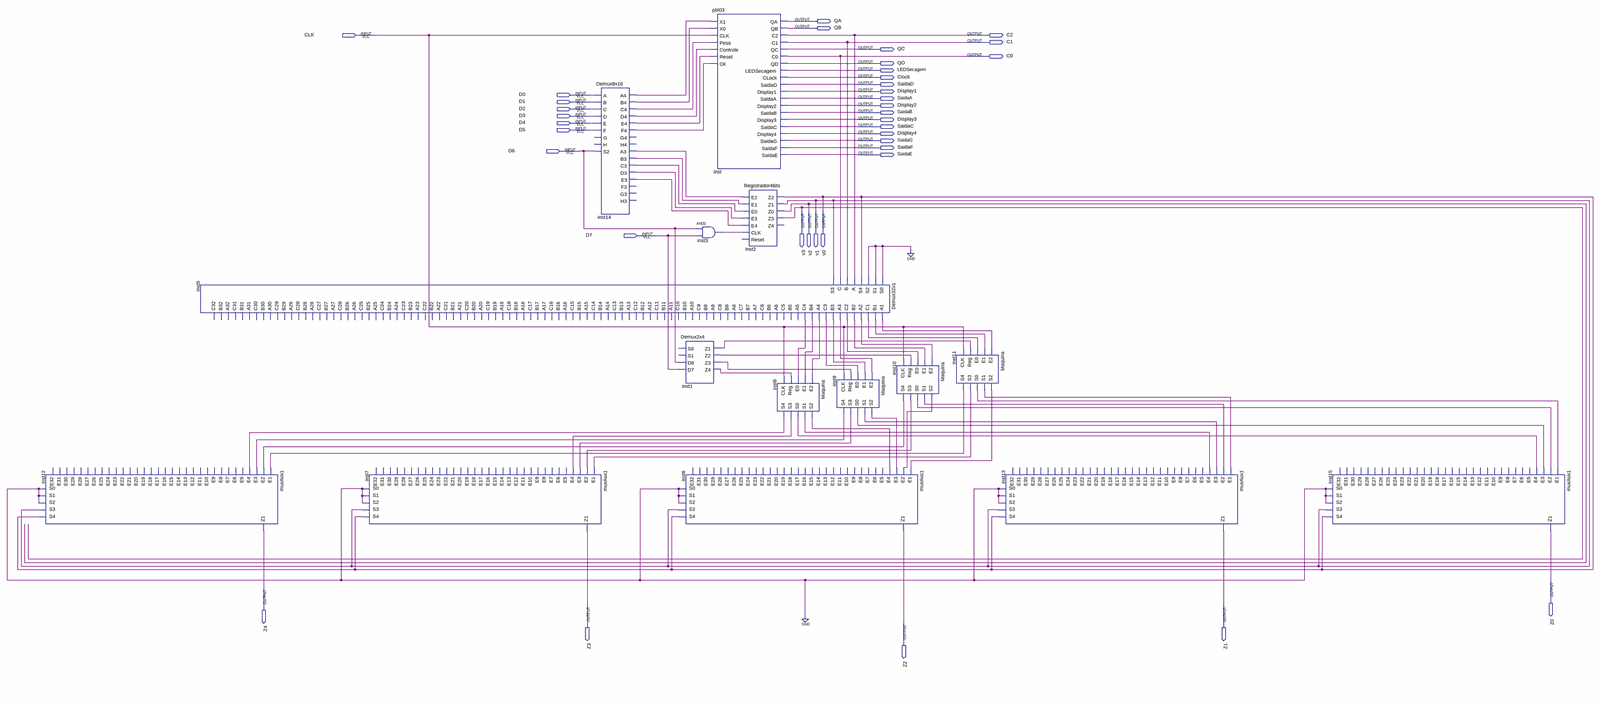
[diagram p0: schematic sheet, whole]
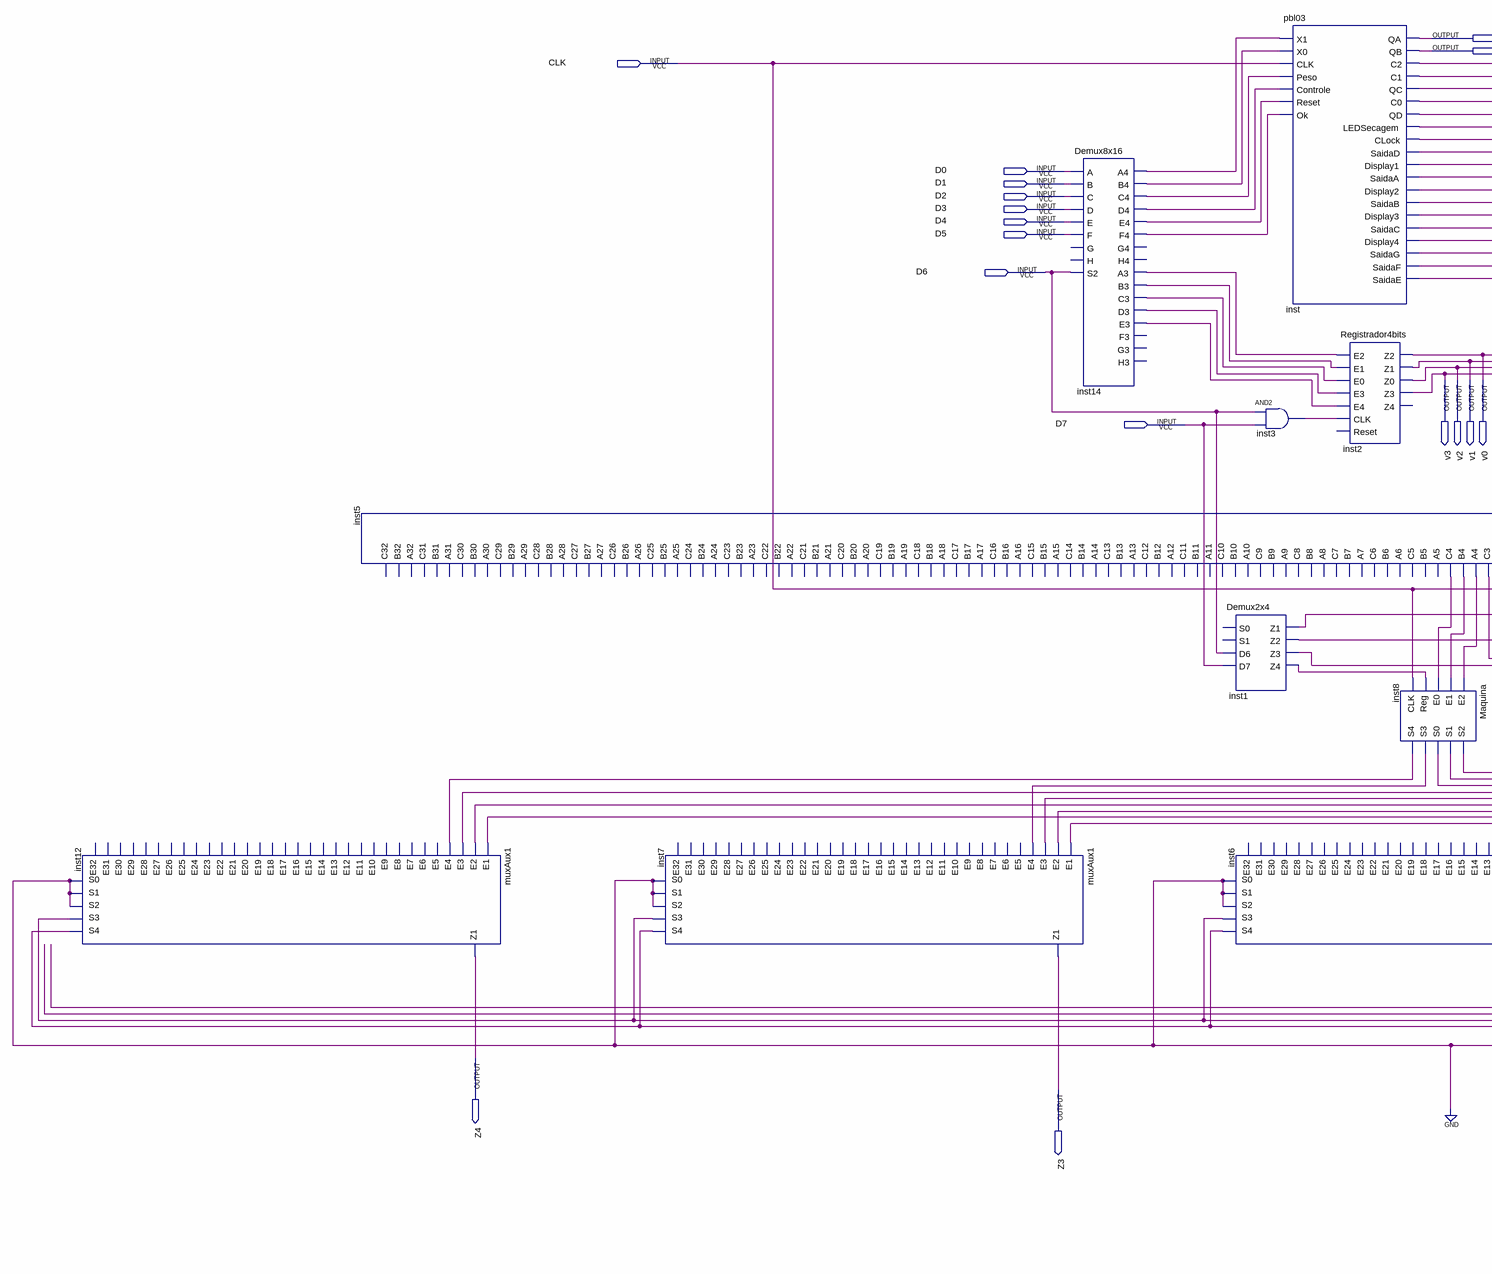
[diagram p1: schematic sheet, left part]
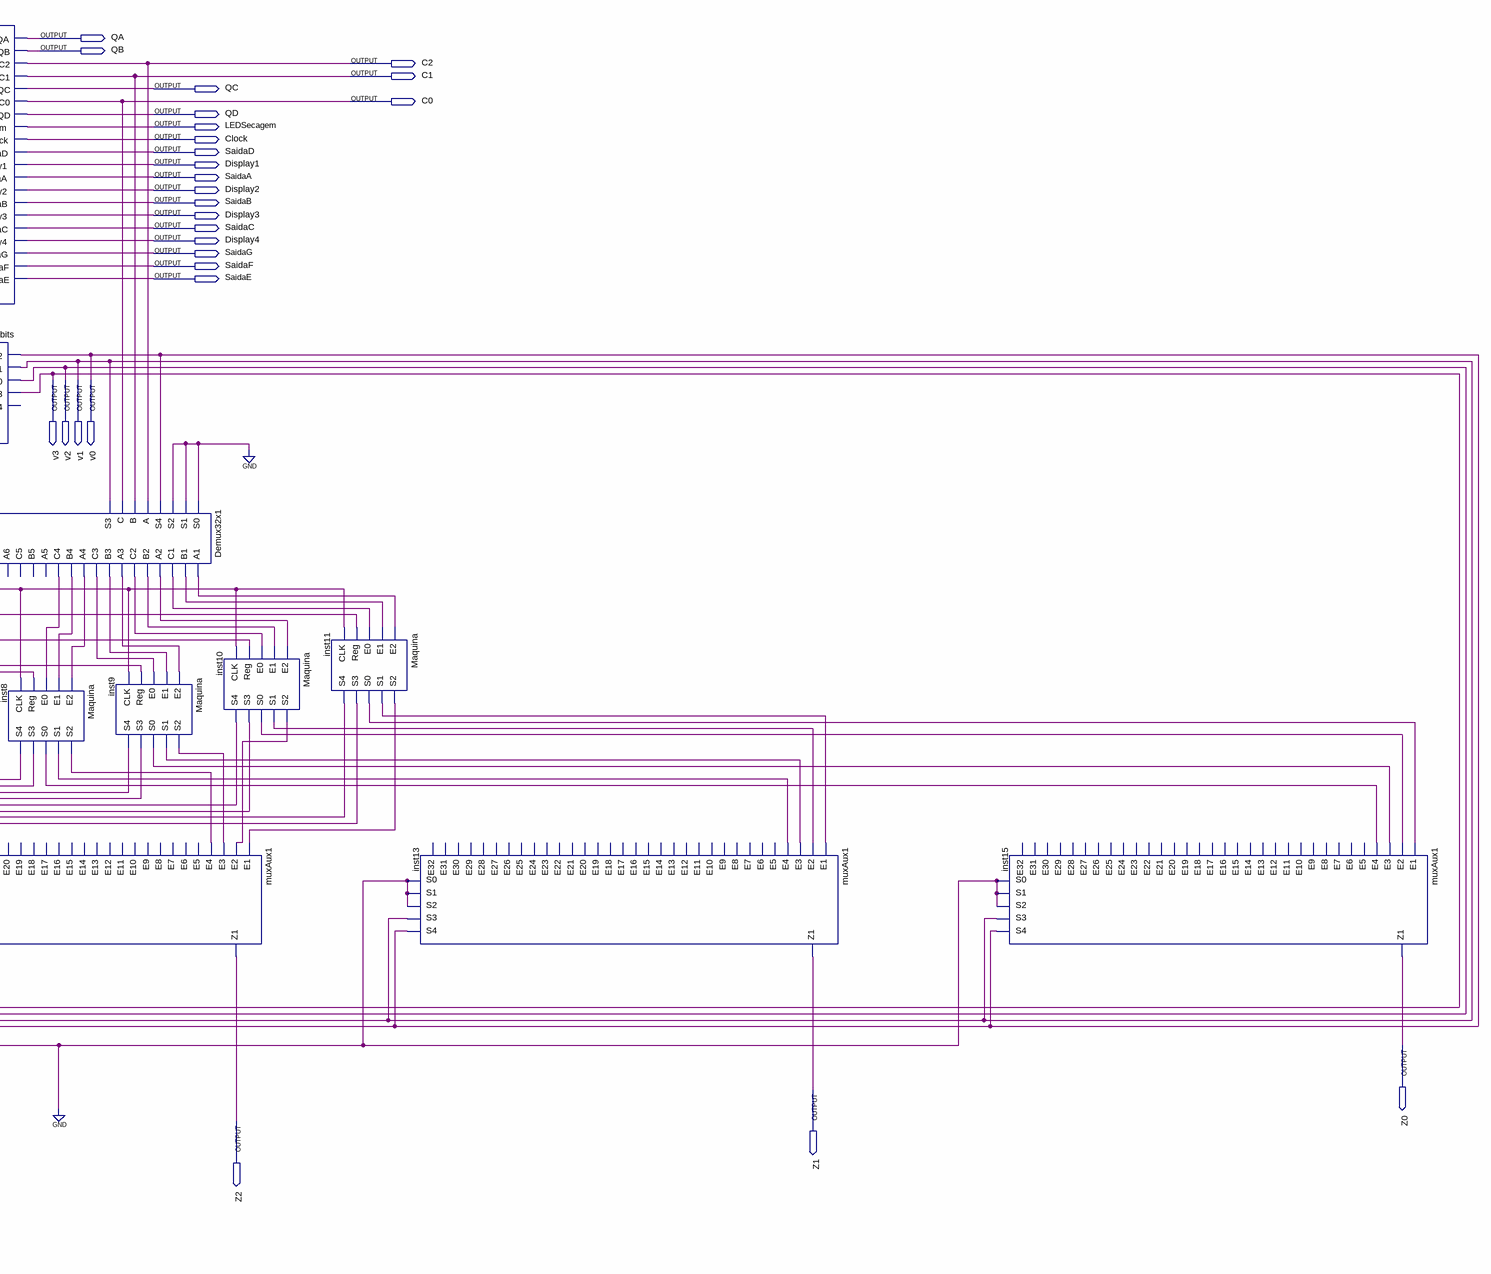
[diagram p2: schematic sheet, right part]
// Quartus schematic PBL4.bdf as structural Verilog: 15 symbols, 38 pins
module PBL4 (
  input  CLK,
  input  D0,
  input  D1,
  input  D2,
  input  D3,
  input  D4,
  input  D5,
  input  D6,
  input  D7,
  output QA,
  output QB,
  output C2,
  output C1,
  output QC,
  output C0,
  output QD,
  output LEDSecagem,
  output Clock,
  output SaidaD,
  output Display1,
  output SaidaA,
  output Display2,
  output SaidaB,
  output Display3,
  output SaidaC,
  output Display4,
  output SaidaG,
  output SaidaF,
  output SaidaE,
  output v3,
  output v2,
  output v1,
  output v0,
  output Z0,
  output Z4,
  output Z3,
  output Z1,
  output Z2
);

  wire inst1_z1, inst1_z2, inst1_z3, inst1_z4, inst3_out, inst5_a1, inst5_a2, inst5_a3, inst5_a4, inst5_b1,
       inst5_b2, inst5_b3, inst5_b4, inst5_c1, inst5_c2, inst5_c3, inst5_c4, inst8_s0, inst8_s1, inst8_s2,
       inst8_s3, inst8_s4, inst9_s0, inst9_s1, inst9_s2, inst9_s3, inst9_s4, inst10_s0, inst10_s1, inst10_s2,
       inst10_s3, inst10_s4, inst11_s0, inst11_s1, inst11_s2, inst11_s3, inst11_s4, inst14_a3, inst14_a4,
       inst14_b3, inst14_b4, inst14_c3, inst14_c4, inst14_d3, inst14_d4, inst14_e3, inst14_e4, inst14_f4;

  muxAux1 inst12 (
    .S0(1'b0), .S1(1'b0), .S2(1'b0), .S3(v1), .S4(v0), .E1(inst11_s4), .E2(inst10_s4), .E3(inst9_s4),
    .E4(inst8_s4), .Z1(Z4));  // open: E5, E6, E7, E8, E9, E10, E11, E12, E13, E14, E15, E16, E17, E18, E19, E20, E21, E22, E23, E24, E25, E26, E27, E28, E29, E30, E31, E32
  Demux32x1 inst5 (
    .S0(1'b0), .S1(1'b0), .S2(1'b0), .S4(v0), .A(C2), .B(C1), .C(C0), .S3(v1), .A1(inst5_a1), .B1(inst5_b1),
    .C1(inst5_c1), .A2(inst5_a2), .B2(inst5_b2), .C2(inst5_c2), .A3(inst5_a3), .B3(inst5_b3), .C3(inst5_c3),
    .A4(inst5_a4), .B4(inst5_b4), .C4(inst5_c4));  // open: A5, B5, C5, A6, B6, C6, A7, B7, C7, A8, B8, C8, A9, B9, C9, A10, B10, C10, A11, B11, C11, A12, B12, C12, A13, B13, C13, A14, B14, C14, A15, B15, C15, A16, B16, C16, A17, B17, C17, A18, B18, C18, A19, B19, C19, A20, B20, C20, A21, B21, C21, A22, B22, C22, A23, B23, C23, A24, B24, C24, A25, B25, C25, A26, B26, C26, A27, B27, C27, A28, B28, C28, A29, B29, C29, A30, B30, C30, A31, B31, C31, A32, B32, C32
  muxAux1 inst7 (
    .S0(1'b0), .S1(1'b0), .S2(1'b0), .S3(v1), .S4(v0), .E1(inst11_s3), .E2(inst10_s3), .E3(inst9_s3),
    .E4(inst8_s3), .Z1(Z3));  // open: E5, E6, E7, E8, E9, E10, E11, E12, E13, E14, E15, E16, E17, E18, E19, E20, E21, E22, E23, E24, E25, E26, E27, E28, E29, E30, E31, E32
  Demux8x16 inst14 (
    .A(D0), .B(D1), .C(D2), .D(D3), .E(D4), .F(D5), .S2(D6), .A4(inst14_a4), .B4(inst14_b4), .C4(inst14_c4),
    .D4(inst14_d4), .E4(inst14_e4), .F4(inst14_f4), .A3(inst14_a3), .B3(inst14_b3), .C3(inst14_c3),
    .D3(inst14_d3), .E3(inst14_e3));  // open: G, H, G4, H4, F3, G3, H3
  Demux2x4 inst1 (.D6(D6), .D7(D7), .Z1(inst1_z1), .Z2(inst1_z2), .Z3(inst1_z3), .Z4(inst1_z4));  // open: S0, S1
  muxAux1 inst6 (
    .S0(1'b0), .S1(1'b0), .S2(1'b0), .S3(v1), .S4(v0), .E1(inst11_s2), .E2(inst10_s2), .E3(inst9_s2),
    .E4(inst8_s2), .Z1(Z2));  // open: E5, E6, E7, E8, E9, E10, E11, E12, E13, E14, E15, E16, E17, E18, E19, E20, E21, E22, E23, E24, E25, E26, E27, E28, E29, E30, E31, E32
  pbl03 inst (
    .X1(inst14_a4), .X0(inst14_b4), .CLK(CLK), .Peso(inst14_c4), .Controle(inst14_d4), .Reset(inst14_e4),
    .Ok(inst14_f4), .QA(QA), .QB(QB), .C2(C2), .C1(C1), .QC(QC), .C0(C0), .QD(QD), .LEDSecagem(LEDSecagem),
    .CLock(Clock), .SaidaD(SaidaD), .Display1(Display1), .SaidaA(SaidaA), .Display2(Display2),
    .SaidaB(SaidaB), .Display3(Display3), .SaidaC(SaidaC), .Display4(Display4), .SaidaG(SaidaG),
    .SaidaF(SaidaF), .SaidaE(SaidaE));
  and inst3 (inst3_out, D6, D7);
  Registrador4bits inst2 (
    .E2(inst14_a3), .E1(inst14_b3), .E0(inst14_c3), .CLK(inst3_out), .E3(inst14_d3), .E4(inst14_e3), .Z2(v0),
    .Z1(v1), .Z0(v2), .Z3(v3));  // open: Reset, Z4
  Maquina inst8 (
    .E2(inst5_a4), .E1(inst5_b4), .E0(inst5_c4), .Reg(inst1_z4), .CLK(CLK), .S2(inst8_s2), .S1(inst8_s1),
    .S0(inst8_s0), .S3(inst8_s3), .S4(inst8_s4));
  Maquina inst9 (
    .E2(inst5_a3), .E1(inst5_b3), .E0(inst5_c3), .Reg(inst1_z3), .CLK(CLK), .S2(inst9_s2), .S1(inst9_s1),
    .S0(inst9_s0), .S3(inst9_s3), .S4(inst9_s4));
  Maquina inst10 (
    .E2(inst5_a2), .E1(inst5_b2), .E0(inst5_c2), .Reg(inst1_z2), .CLK(CLK), .S2(inst10_s2), .S1(inst10_s1),
    .S0(inst10_s0), .S3(inst10_s3), .S4(inst10_s4));
  Maquina inst11 (
    .E2(inst5_a1), .E1(inst5_b1), .E0(inst5_c1), .Reg(inst1_z1), .CLK(CLK), .S2(inst11_s2), .S1(inst11_s1),
    .S0(inst11_s0), .S3(inst11_s3), .S4(inst11_s4));
  muxAux1 inst13 (
    .S0(1'b0), .S1(1'b0), .S2(1'b0), .S3(v1), .S4(v0), .E1(inst11_s1), .E2(inst10_s1), .E3(inst9_s1),
    .E4(inst8_s1), .Z1(Z1));  // open: E5, E6, E7, E8, E9, E10, E11, E12, E13, E14, E15, E16, E17, E18, E19, E20, E21, E22, E23, E24, E25, E26, E27, E28, E29, E30, E31, E32
  muxAux1 inst15 (
    .S0(1'b0), .S1(1'b0), .S2(1'b0), .S3(v1), .S4(v0), .E1(inst11_s0), .E2(inst10_s0), .E3(inst9_s0),
    .E4(inst8_s0), .Z1(Z0));  // open: E5, E6, E7, E8, E9, E10, E11, E12, E13, E14, E15, E16, E17, E18, E19, E20, E21, E22, E23, E24, E25, E26, E27, E28, E29, E30, E31, E32
endmodule
